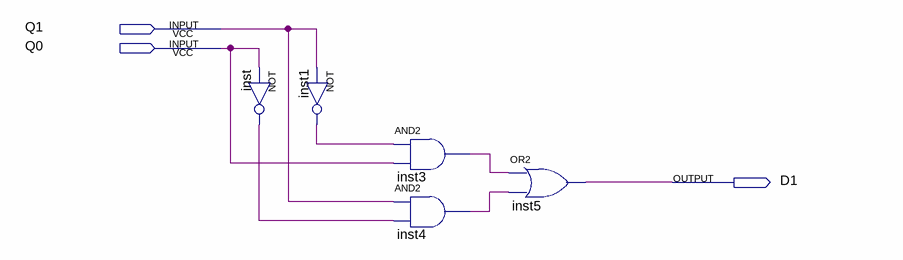
[diagram p0: schematic sheet]
// Quartus schematic D1.bdf as structural Verilog: 5 symbols, 3 pins
module D1 (
  input  Q1,
  input  Q0,
  output D1
);

  wire inst1_out, inst3_out, inst4_out, inst_out;

  not inst (inst_out, Q0);
  not inst1 (inst1_out, Q1);
  and inst3 (inst3_out, inst1_out, Q0);
  and inst4 (inst4_out, Q1, inst_out);
  or inst5 (D1, inst3_out, inst4_out);
endmodule
